# Altium schematic sheet MCU.SchDoc
size A4
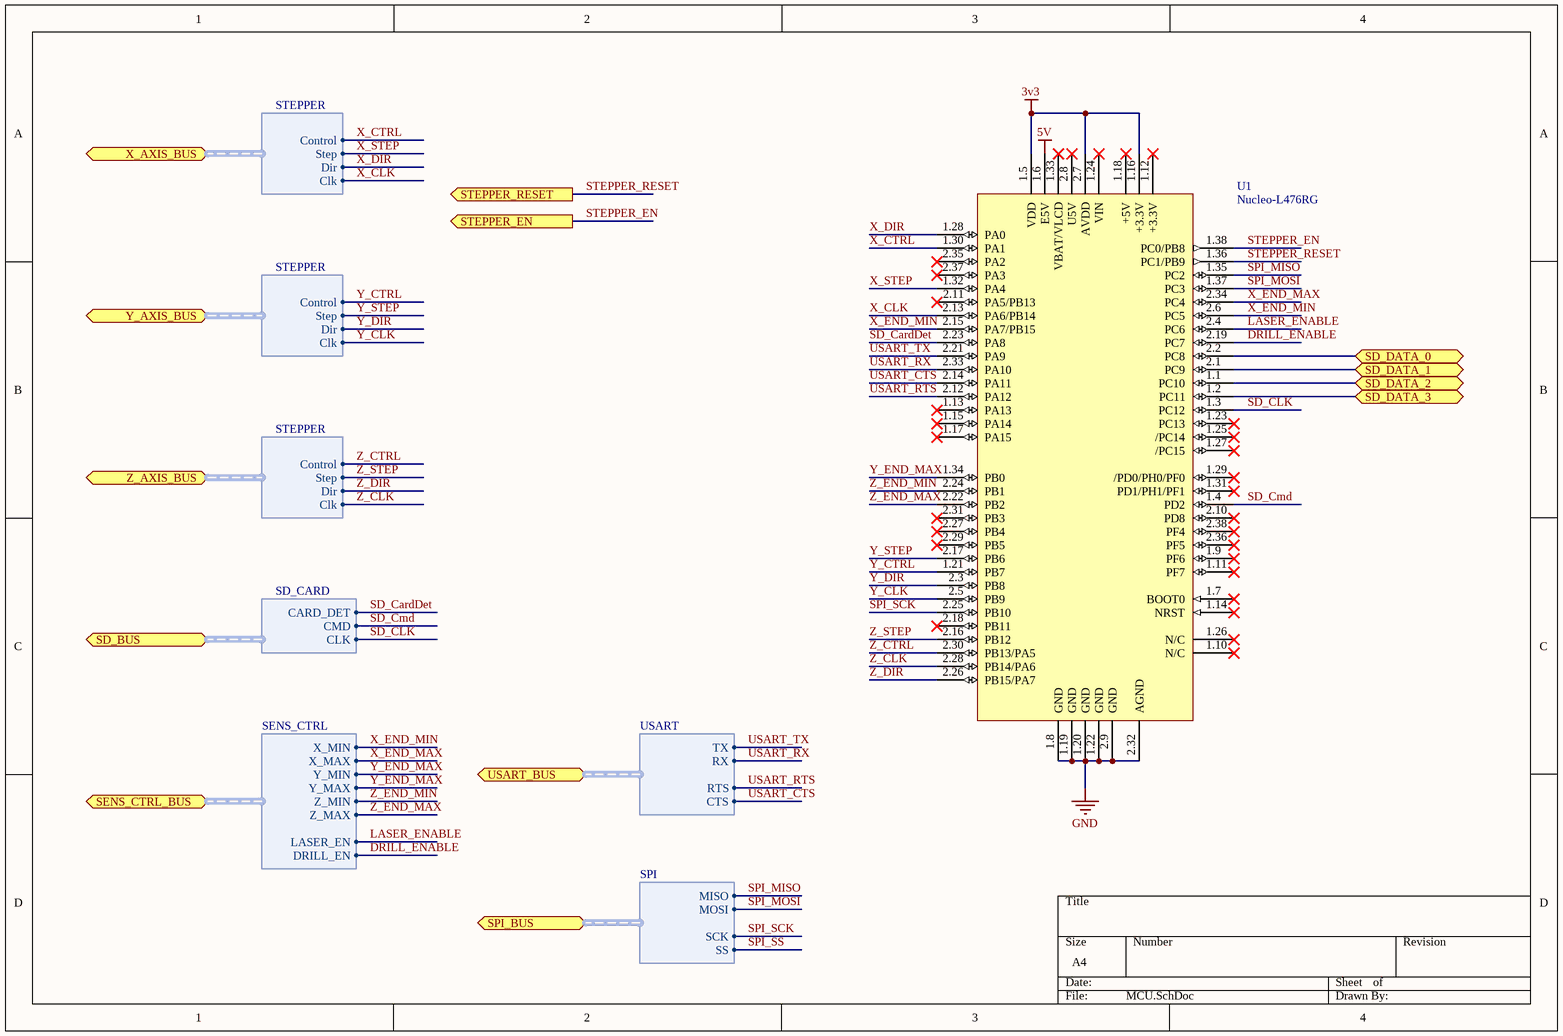
[diagram p0: MCU.SchDoc]

## Parts
U1  Nucleo-L476RG  [NUCLEO--F103RB]

## Ports
SD_BUS (harness SD_CARD), SD_DATA_0 (bidir), SD_DATA_1 (bidir), SD_DATA_2 (bidir), SD_DATA_3 (bidir), SENS_CTRL_BUS (harness SENS_CTRL), SPI_BUS (harness SPI), STEPPER_EN (out), STEPPER_RESET (out), USART_BUS (harness USART), X_AXIS_BUS (harness STEPPER), Y_AXIS_BUS (harness STEPPER), Z_AXIS_BUS (harness STEPPER)

## Harnesses
STEPPER: Clk, Dir, Step, Control
SD_CARD: CARD_DET, CMD, CLK
SENS_CTRL: X_MIN, X_MAX, Y_MIN, Y_MAX, Z_MIN, Z_MAX, LASER_EN, DRILL_EN
USART: TX, RX, RTS, CTS
SPI: MISO, MOSI, SCK, SS

## Nets
3v3: U1.1.5(VDD) U1.1.16(+3.3V) U1.2.7(AVDD)
5V: U1.1.6(E5V)
GND: U1.1.8(GND) U1.1.19(GND) U1.1.20(GND) U1.1.22(GND) U1.2.9(GND) U1.2.32(AGND)
DRILL_ENABLE: U1.2.19(PC7) ; port SENS_CTRL_BUS.DRILL_EN
LASER_ENABLE: U1.2.4(PC6) ; port SENS_CTRL_BUS.LASER_EN
SD_CardDet: U1.2.23(PA8) ; port SD_BUS.CARD_DET
SD_CLK: U1.1.3(PC12) ; port SD_BUS.CLK
SD_Cmd: U1.1.4(PD2) ; port SD_BUS.CMD
SD_DATA_0: U1.2.2(PC8) ; port SD_DATA_0
SD_DATA_1: U1.2.1(PC9) ; port SD_DATA_1
SD_DATA_2: U1.1.1(PC10) ; port SD_DATA_2
SD_DATA_3: U1.1.2(PC11) ; port SD_DATA_3
SPI_MISO: U1.1.35(PC2) ; port SPI_BUS.MISO
SPI_MOSI: U1.1.37(PC3) ; port SPI_BUS.MOSI
SPI_SCK: U1.2.25(PB10) ; port SPI_BUS.SCK
SPI_SS: port SPI_BUS.SS
STEPPER_EN: U1.1.38(PC0/PB8) ; port STEPPER_EN
STEPPER_RESET: U1.1.36(PC1/PB9) ; port STEPPER_RESET
USART_CTS: U1.2.14(PA11) ; port USART_BUS.CTS
USART_RTS: U1.2.12(PA12) ; port USART_BUS.RTS
USART_RX: U1.2.33(PA10) ; port USART_BUS.RX
USART_TX: U1.2.21(PA9) ; port USART_BUS.TX
X_CLK: U1.2.13(PA6/PB14) ; port X_AXIS_BUS.Clk
X_CTRL: U1.1.30(PA1) ; port X_AXIS_BUS.Control
X_DIR: U1.1.28(PA0) ; port X_AXIS_BUS.Dir
X_END_MAX: U1.2.34(PC4) ; port SENS_CTRL_BUS.X_MAX
X_END_MIN: U1.2.6(PC5) U1.2.15(PA7/PB15) ; port SENS_CTRL_BUS.X_MIN
X_STEP: U1.1.32(PA4) ; port X_AXIS_BUS.Step
Y_CLK: U1.2.5(PB9) ; port Y_AXIS_BUS.Clk
Y_CTRL: U1.1.21(PB7) ; port Y_AXIS_BUS.Control
Y_DIR: U1.2.3(PB8) ; port Y_AXIS_BUS.Dir
Y_END_MAX: U1.1.34(PB0) ; port SENS_CTRL_BUS.Y_MIN, port SENS_CTRL_BUS.Y_MAX
Y_STEP: U1.2.17(PB6) ; port Y_AXIS_BUS.Step
Z_CLK: U1.2.28(PB14/PA6) ; port Z_AXIS_BUS.Clk
Z_CTRL: U1.2.30(PB13/PA5) ; port Z_AXIS_BUS.Control
Z_DIR: U1.2.26(PB15/PA7) ; port Z_AXIS_BUS.Dir
Z_END_MAX: U1.2.22(PB2) ; port SENS_CTRL_BUS.Z_MAX
Z_END_MIN: U1.2.24(PB1) ; port SENS_CTRL_BUS.Z_MIN
Z_STEP: U1.2.16(PB12) ; port Z_AXIS_BUS.Step

Not connected (* = marked no-connect by the designer): U1 1.7(BOOT0)* 1.9(PF6)* 1.10(N/C)* 1.11(PF7)* 1.12(+3.3V)* 1.13(PA13)* 1.14(NRST)* 1.15(PA14)* 1.17(PA15)* 1.18(+5V)* 1.23(PC13)* 1.24(VIN)* 1.25(/PC14)* 1.26(N/C)* 1.27(/PC15)* 1.29(/PD0/PH0/PF0)* 1.31(PD1/PH1/PF1)* 1.33(VBAT/VLCD)* 2.8(U5V)* 2.10(PD8)* 2.11(PA5/PB13)* 2.18(PB11)* 2.27(PB4)* 2.29(PB5)* 2.31(PB3)* 2.35(PA2)* 2.36(PF5)* 2.37(PA3)* 2.38(PF4)*

## Library data of the parts
U1 = Nucleo-F103RB